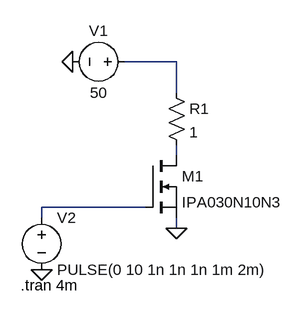
[diagram p0: schematic Draft1.asc]
Draft1.asc, the LTspice schematic file:
Version 4.1
SHEET 1 880 680
WIRE 240 64 160 64
WIRE 240 112 240 64
WIRE 240 208 240 192
WIRE 192 288 32 288
WIRE 32 304 32 288
WIRE 240 320 240 304
FLAG 240 320 0
FLAG 80 64 0
FLAG 32 384 0
SYMBOL voltage 176 64 R90
WINDOW 0 -32 56 VBottom 2
WINDOW 3 32 56 VTop 2
SYMATTR InstName V1
SYMATTR Value 50
SYMBOL res 224 96 R0
SYMATTR InstName R1
SYMATTR Value 1
SYMBOL nmos 192 208 R0
SYMATTR InstName M1
SYMATTR Value IPA030N10N3
SYMBOL voltage 32 288 R0
WINDOW 123 0 0 Left 0
WINDOW 39 0 0 Left 0
SYMATTR InstName V2
SYMATTR Value PULSE(0 10 1n 1n 1n 1m 2m)
TEXT 0 408 Left 2 !.tran 4m

The netlist it stands for:
* Draft1.asc
V1 N001 0 50
R1 N001 N002 1
M1 N002 N003 0 0 IPA030N10N3
V2 N003 0 PULSE(0 10 1n 1n 1n 1m 2m)
.model NMOS NMOS
.model PMOS PMOS
.lib standard.mos
.tran 4m
.backanno
.end